# EAGLE design ArduinoUNO_Connexions (EAGLE 9.2.1)
Assembly variants: Actual
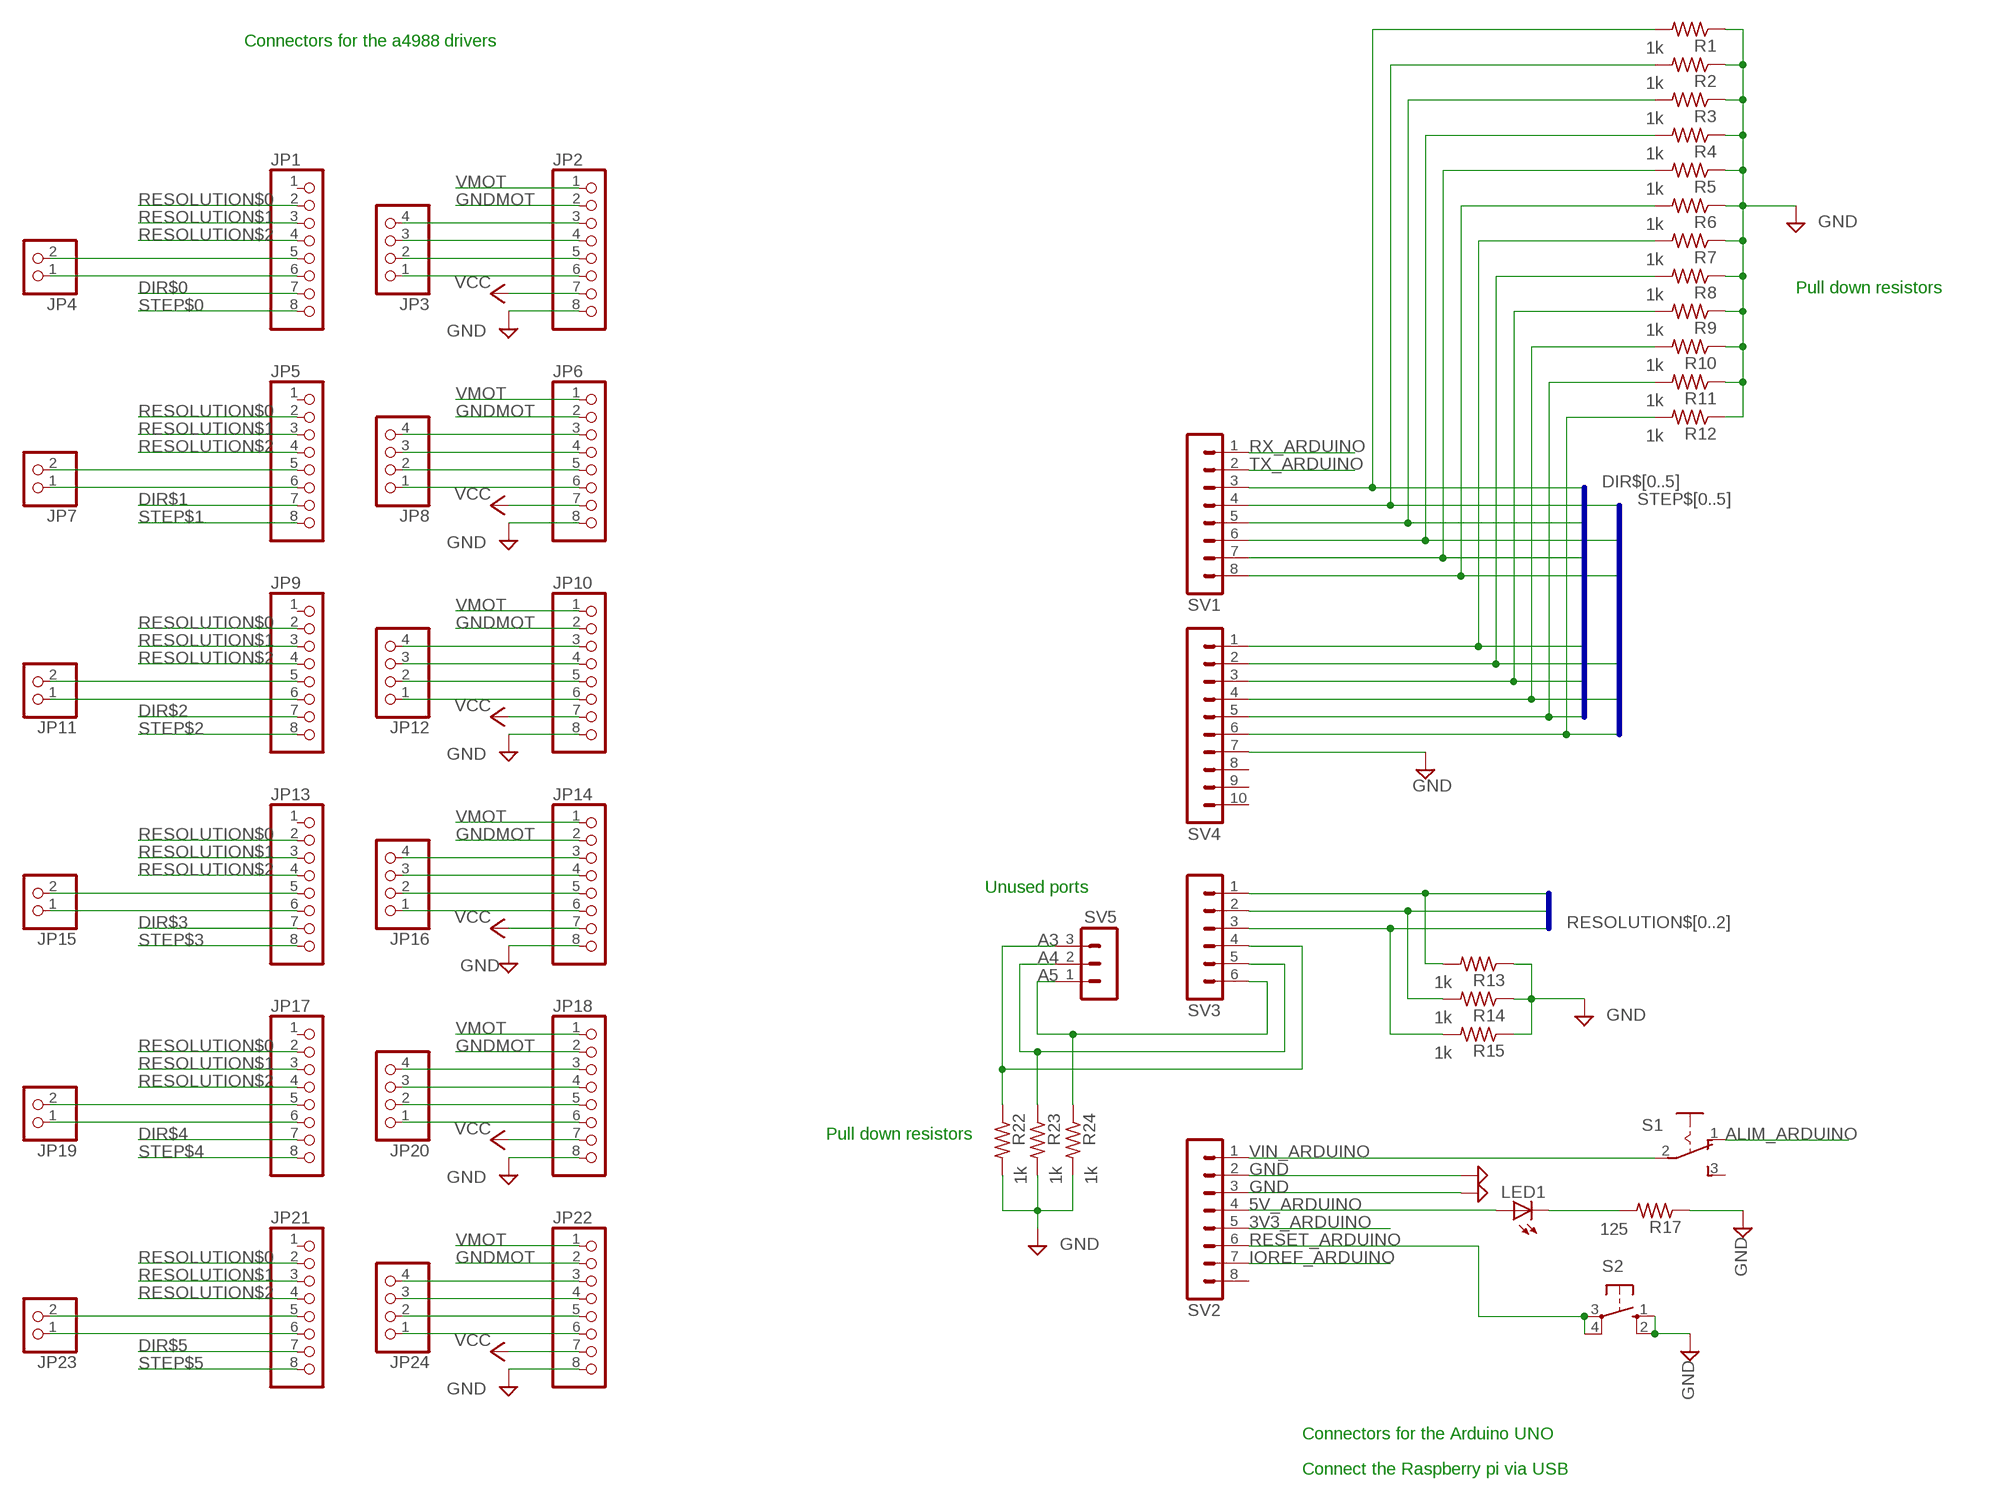
[diagram p0: schematic, sheet 1, part 1 of 2]
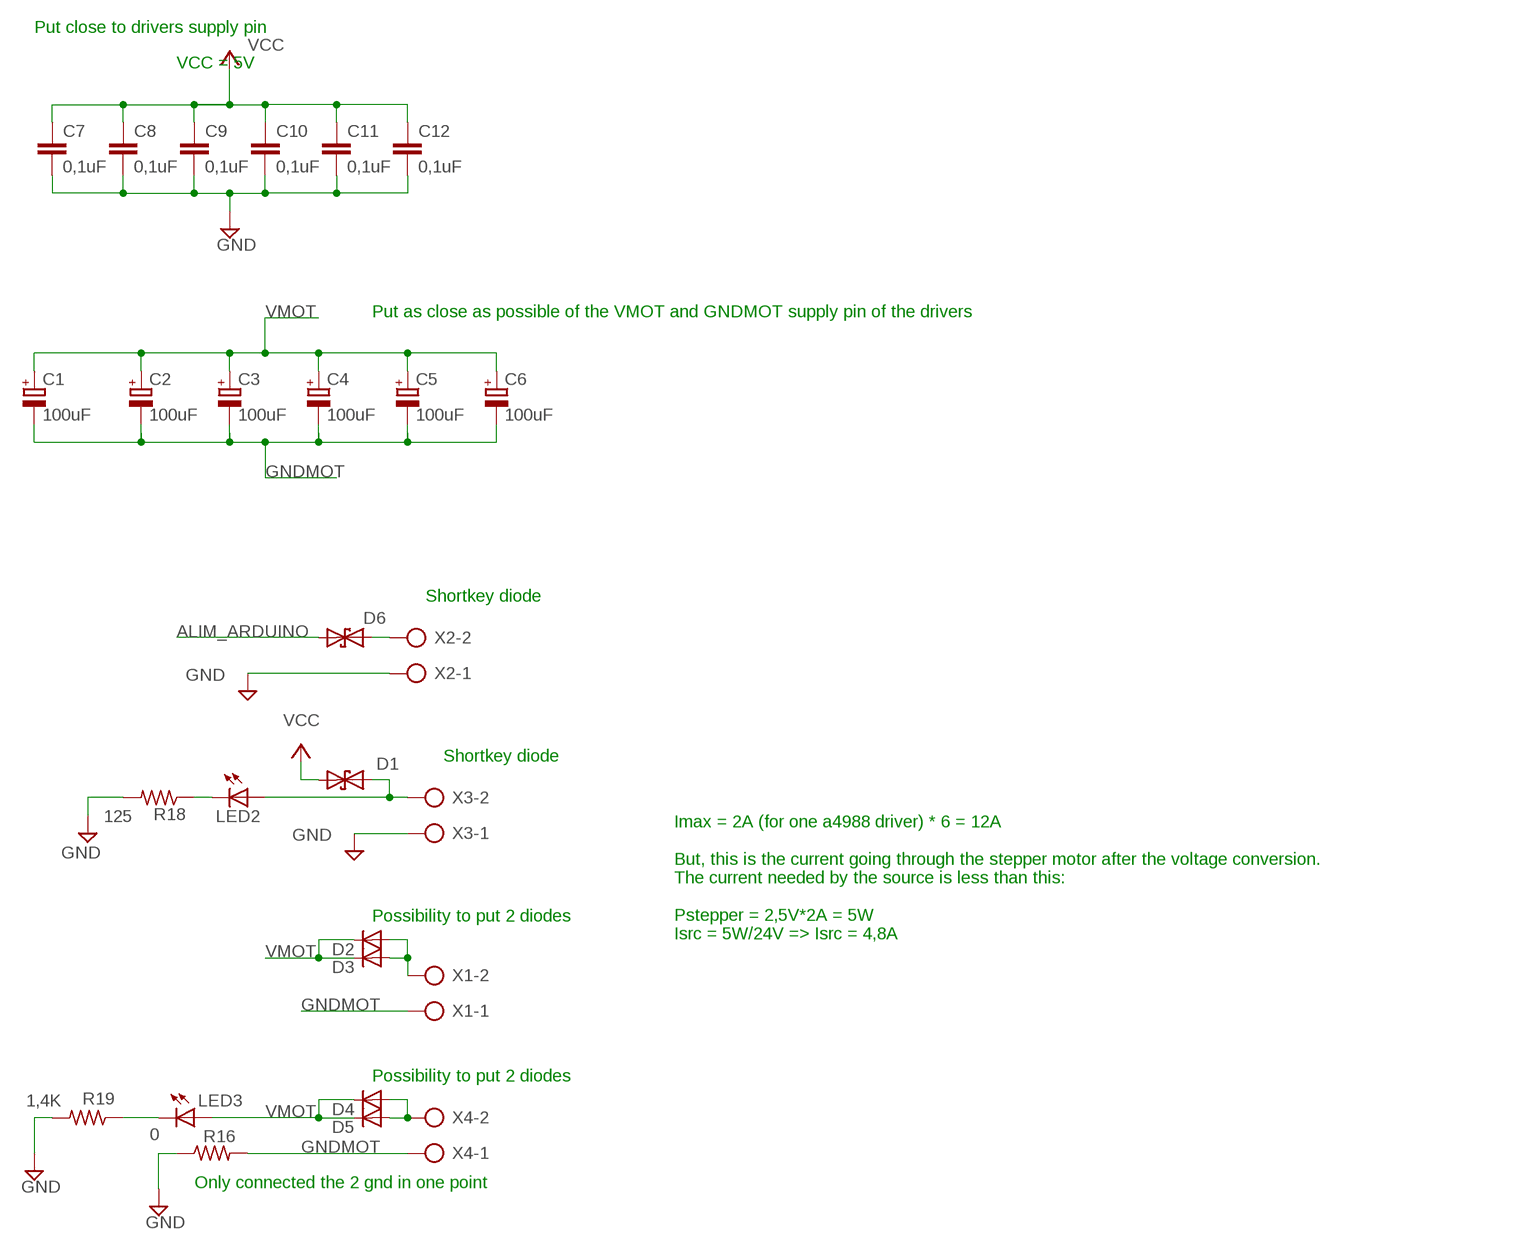
[diagram p1: schematic, sheet 1, part 2 of 2]

## Parts
C1  100uF  CPOL-EUE5-10.5  [E5-10,5]
C2  100uF  CPOL-EUE5-10.5  [E5-10,5]
C3  100uF  CPOL-EUE5-10.5  [E5-10,5]
C4  100uF  CPOL-EUE5-10.5  [E5-10,5]
C5  100uF  CPOL-EUE5-10.5  [E5-10,5]
C6  100uF  CPOL-EUE5-10.5  [E5-10,5]
C7  0,1uF  C-EU050-030X075  [C050-030X075]
C8  0,1uF  C-EU050-030X075  [C050-030X075]
C9  0,1uF  C-EU050-030X075  [C050-030X075]
C10  0,1uF  C-EU050-030X075  [C050-030X075]
C11  0,1uF  C-EU050-030X075  [C050-030X075]
C12  0,1uF  C-EU050-030X075  [C050-030X075]
D1  DIODE_SCHOTTKY2-F126-12  [F126Z12]
D2  1N5400  [DO201-15]
D3  1N5400  [DO201-15]
D4  1N5400  [DO201-15]
D5  1N5400  [DO201-15]
D6  DIODE_SCHOTTKY2-F126-12  [F126Z12]
JP1  PINHD-1X8  [1X08]
JP2  PINHD-1X8  [1X08]
JP3  PINHD-1X4  [1X04]
JP4  PINHD-1X2  [1X02]
JP5  PINHD-1X8  [1X08]
JP6  PINHD-1X8  [1X08]
JP7  PINHD-1X2  [1X02]
JP8  PINHD-1X4  [1X04]
JP9  PINHD-1X8  [1X08]
JP10  PINHD-1X8  [1X08]
JP11  PINHD-1X2  [1X02]
JP12  PINHD-1X4  [1X04]
JP13  PINHD-1X8  [1X08]
JP14  PINHD-1X8  [1X08]
JP15  PINHD-1X2  [1X02]
JP16  PINHD-1X4  [1X04]
JP17  PINHD-1X8  [1X08]
JP18  PINHD-1X8  [1X08]
JP19  PINHD-1X2  [1X02]
JP20  PINHD-1X4  [1X04]
JP21  PINHD-1X8  [1X08]
JP22  PINHD-1X8  [1X08]
JP23  PINHD-1X2  [1X02]
JP24  PINHD-1X4  [1X04]
LED1  LED5MM  [LED5MM]
LED2  LED5MM  [LED5MM]
LED3  LED5MM  [LED5MM]
R1  1k  R-US_0207/7  [0207/7]  (not fitted in variant Actual)
R2  1k  R-US_0207/7  [0207/7]  (not fitted in variant Actual)
R3  1k  R-US_0207/7  [0207/7]  (not fitted in variant Actual)
R4  1k  R-US_0207/7  [0207/7]  (not fitted in variant Actual)
R5  1k  R-US_0207/7  [0207/7]  (not fitted in variant Actual)
R6  1k  R-US_0207/7  [0207/7]  (not fitted in variant Actual)
R7  1k  R-US_0207/7  [0207/7]  (not fitted in variant Actual)
R8  1k  R-US_0207/7  [0207/7]  (not fitted in variant Actual)
R9  1k  R-US_0207/7  [0207/7]  (not fitted in variant Actual)
R10  1k  R-US_0207/7  [0207/7]  (not fitted in variant Actual)
R11  1k  R-US_0207/7  [0207/7]  (not fitted in variant Actual)
R12  1k  R-US_0207/7  [0207/7]  (not fitted in variant Actual)
R13  1k  R-US_0207/7  [0207/7]  (not fitted in variant Actual)
R14  1k  R-US_0207/7  [0207/7]  (not fitted in variant Actual)
R15  1k  R-US_0207/7  [0207/7]  (not fitted in variant Actual)
R16  0  R-US_0207/7  [0207/7]
R17  125  R-US_0207/7  [0207/7]
R18  125  R-US_0207/7  [0207/7]
R19  1,4K  R-US_0207/7  [0207/7]
R22  1k  R-US_0207/7  [0207/7]  (not fitted in variant Actual)
R23  1k  R-US_0207/7  [0207/7]  (not fitted in variant Actual)
R24  1k  R-US_0207/7  [0207/7]  (not fitted in variant Actual)
S1  255SB  [255SB]  (not fitted in variant Actual)
S2  10-XX  [B3F-10XX]
SV1  MA08-1  [MA08-1]
SV2  MA08-1  [MA08-1]
SV3  MA06-1  [MA06-1]
SV4  MA10-1  [MA10-1]
SV5  MA03-1  [MA03-1]
X1  AK500/2  [AK500/2]
X2  AK500/2  [AK500/2]
X3  AK500/2  [AK500/2]
X4  AK500/2  [AK500/2]

## Nets
3V3_ARDUINO: SV2.5
5V_ARDUINO: LED1.A SV2.4
A3: R22.1 SV3.4 SV5.3
A4: R23.1 SV3.5 SV5.2
A5: R24.1 SV3.6 SV5.1
ALIM_ARDUINO: D6.C S1.1(O)
DIR$0: JP1.7 R1.2 SV1.3
DIR$1: JP5.7 R3.2 SV1.5
DIR$2: JP9.7 R5.2 SV1.7
DIR$3: JP13.7 R7.2 SV4.1
DIR$4: JP17.7 R9.2 SV4.3
DIR$5: JP21.7 R11.2 SV4.5
GND: C7.2 C8.2 C9.2 C10.2 C11.2 C12.2 JP2.8 JP6.8 JP10.8 JP14.8 JP18.8 JP22.8 R1.1 R2.1 R3.1 R4.1 R5.1 R6.1 R7.1 R8.1 R9.1 R10.1 R11.1 R12.1 R13.1 R14.1 R15.1 R16.1 R17.1 R18.2 R19.2 R22.2 R23.2 R24.2 S2.1(S) S2.2(S1) SV2.2 SV2.3 SV4.7 X2.1 X3.1
GNDMOT: C1.- C2.- C3.- C4.- C5.- C6.- JP2.2 JP6.2 JP10.2 JP14.2 JP18.2 JP22.2 R16.2 X1.1 X4.1
IOREF_ARDUINO: SV2.7
N$1: D4.A D5.A X4.2
N$2: D1.A LED2.A X3.2
N$4: LED1.K(C) R17.2
N$5: JP2.3 JP3.4
N$6: LED3.K(C) R19.1
N$7: LED2.K(C) R18.1
N$8: JP2.4 JP3.3
N$9: JP2.5 JP3.2
N$10: JP1.5 JP4.2
N$11: JP1.6 JP4.1
N$12: JP2.6 JP3.1
N$13: JP5.5 JP7.2
N$14: JP5.6 JP7.1
N$15: JP6.3 JP8.4
N$16: JP6.4 JP8.3
N$17: JP6.5 JP8.2
N$18: JP6.6 JP8.1
N$19: JP9.5 JP11.2
N$20: JP9.6 JP11.1
N$21: JP10.3 JP12.4
N$22: JP10.4 JP12.3
N$23: JP10.5 JP12.2
N$24: JP10.6 JP12.1
N$25: JP13.5 JP15.2
N$26: JP13.6 JP15.1
N$27: JP14.3 JP16.4
N$28: JP14.4 JP16.3
N$29: JP14.5 JP16.2
N$30: JP14.6 JP16.1
N$31: JP17.5 JP19.2
N$32: JP17.6 JP19.1
N$33: JP18.3 JP20.4
N$34: JP18.4 JP20.3
N$35: JP18.5 JP20.2
N$36: JP18.6 JP20.1
N$37: JP21.5 JP23.2
N$38: JP21.6 JP23.1
N$39: JP22.3 JP24.4
N$40: JP22.4 JP24.3
N$41: JP22.5 JP24.2
N$42: JP22.6 JP24.1
N$44: D6.A X2.2
N$56: D2.A D3.A X1.2
RESET_ARDUINO: S2.3(P) S2.4(P1) SV2.6
RESOLUTION$0: JP1.2 JP5.2 JP9.2 JP13.2 JP17.2 JP21.2 R13.2 SV3.1
RESOLUTION$1: JP1.3 JP5.3 JP9.3 JP13.3 JP17.3 JP21.3 R14.2 SV3.2
RESOLUTION$2: JP1.4 JP5.4 JP9.4 JP13.4 JP17.4 JP21.4 R15.2 SV3.3
RX_ARDUINO: SV1.1
STEP$0: JP1.8 R2.2 SV1.4
STEP$1: JP5.8 R4.2 SV1.6
STEP$2: JP9.8 R6.2 SV1.8
STEP$3: JP13.8 R8.2 SV4.2
STEP$4: JP17.8 R10.2 SV4.4
STEP$5: JP21.8 R12.2 SV4.6
TX_ARDUINO: SV1.2
VCC: C7.1 C8.1 C9.1 C10.1 C11.1 C12.1 D1.C JP2.7 JP6.7 JP10.7 JP14.7 JP18.7 JP22.7
VIN_ARDUINO: S1.2(P) SV2.1
VMOT: C1.+ C2.+ C3.+ C4.+ C5.+ C6.+ D2.C D3.C D4.C D5.C JP2.1 JP6.1 JP10.1 JP14.1 JP18.1 JP22.1 LED3.A
Unconnected: JP1.1 JP5.1 JP9.1 JP13.1 JP17.1 JP21.1 S1.3(S) SV2.8 SV4.8 SV4.9 SV4.10

## Buses
RESOLUTION$[0..2]
STEP$[0..5]
DIR$[0..5]

## Notes on the sheet
- Connectors for the a4988 drivers
- Put close to drivers supply pin
- VCC = 5V
- Pull down resistors
- Put as close as possible of the VMOT and GNDMOT supply pin of the drivers
- Shortkey diode
- Shortkey diode
- Unused ports
- Possibility to put 2 diodes
- Imax = 2A (for one a4988 driver) * 6 = 12A
  
  But, this is the current going through the stepper motor after the voltage conversion.
  The current needed by the source is less than this:
  
  Pstepper = 2,5V*2A = 5W
  Isrc = 5W/24V => Isrc = 4,8A
- Pull down resistors
- Possibility to put 2 diodes
- Only connected the 2 gnd in one point
- Connectors for the Arduino UNO
- Connect the Raspberry pi via USB

## Library data of the parts
C1-C6 = rcl:CPOL-EU: POLARIZED CAPACITOR, European symbol; SPICEPREFIX: C
C7-C12 = rcl:C-EU: CAPACITOR, European symbol; SPICEPREFIX: C
D1 D6 = diode:DIODE_SCHOTTKY2-: Schottky Bidirectional Diode
D2-D5 = diode:1N5400: DIODE standard rectifier, 3 A, 50 V (Motorola)
JP1 JP2 JP5 JP6 JP9 JP10 JP13 JP14 JP17 JP18 JP21 JP22 = pinhead:PINHD-1X8: PIN HEADER
JP3 JP8 JP12 JP16 JP20 JP24 = pinhead:PINHD-1X4: PIN HEADER
JP4 JP7 JP11 JP15 JP19 JP23 = pinhead:PINHD-1X2: PIN HEADER
LED1-LED3 = led:LED: LED OSRAM: - CHIPLED LG R971, LG N971, LY N971, LG Q971, LY Q971, LO R971, LY R971 LH N974, LH R974 LS Q976, LO Q976, LY Q976 LO Q996 - Hyper CHIPLED LW Q18S LB Q993, LB Q99A, LB R99A - SideLED LS A670, LO A670, LY A670, LG A670, LP A670 LB A673, LV A673, LT A673, LW A673 LH A674 LY A675 LS A676, LA A676, LO A676, LY A676, LW A676 LS A679, LY A679, LG A679 - Hyper Micro SIDELED® LS Y876, LA Y876, LO Y876, LY Y876 LT Y87S - SmartLED LW L88C, LW L88S LB L89C, LB L89S, LG L890 LS L89K, LO L89K, LY L89K LS L896, LA L896, LO L896, LY L896 - TOPLED LS T670, LO T670, LY T670, LG T670, LP T670 LSG T670, LSP T670, LSY T670, LOP T670, LYG T670 LG T671, LOG T671, LSG T671 LB T673, LV T673, LT T673, LW T673 LH T674 LS T676, LA T676, LO T676, LY T676, LB T676, LH T676, LSB T676, LW T676 LB T67C, LV T67C, LT T67C, LS T67K, LO T67K, LY T67K, LW E67C LS E67B, LA E67B, LO E67B, LY E67B, LB E67C, LV E67C, LT E67C LW T67C LS T679, LY T679, LG T679 LS T770, LO T770, LY T770, LG T770, LP T770 LB T773, LV T773, LT T773, LW T773 LH T774 LS E675, LA E675, LY E675, LS T675 LS T776, LA T776, LO T776, LY T776, LB T776 LHGB T686 LT T68C, LB T68C - Hyper Mini TOPLED® LB M676 - Mini TOPLED Santana® LG M470 LS M47K, LO M47K, LY M47K Source: http://www.osram.convergy.de LUXEON: - LUMILED® LXK2-PW12-R00, LXK2-PW12-S00, LXK2-PW14-U00, LXK2-PW14-V00 LXK2-PM12-R00, LXK2-PM12-S00, LXK2-PM14-U00 LXK2-PE12-Q00, LXK2-PE12-R00, LXK2-PE12-S00, LXK2-PE14-T00, LXK2-PE14-U00 LXK2-PB12-K00, LXK2-PB12-L00, LXK2-PB12-M00, LXK2-PB14-N00, LXK2-PB14-P00, LXK2-PB14-Q00 LXK2-PR12-L00, LXK2-PR12-M00, LXK2-PR14-Q00, LXK2-PR14-R00 LXK2-PD12-Q00, LXK2-PD12-R00, LXK2-PD12-S00 LXK2-PH12-R00, LXK2-PH12-S00 LXK2-PL12-P00, LXK2-PL12-Q00, LXK2-PL12-R00 Source: www.luxeon.com KINGBRIGHT: KA-3528ASYC Source: www.kingbright.com
R1-R19 R22-R24 = rcl:R-US_: RESISTOR, American symbol; SPICEPREFIX: R
S1 = switch:255SB: SLIDING SWITCH Distributor Buerklin, 11G810
S2 = switch-omron:10-XX: OMRON SWITCH; MPN: B3F-1000; OC_FARNELL: 176432; OC_NEWARK: 36M3542
SV1 SV2 = con-lstb:MA08-1: PIN HEADER; OC_FARNELL: unknown; OC_NEWARK: unknown
SV3 = con-lstb:MA06-1: PIN HEADER; OC_FARNELL: unknown; OC_NEWARK: unknown
SV4 = con-lstb:MA10-1: PIN HEADER; OC_FARNELL: unknown; OC_NEWARK: unknown
SV5 = con-lstb:MA03-1: PIN HEADER; OC_FARNELL: unknown; OC_NEWARK: unknown
X1-X4 = con-ptr500:AK500/2: CONNECTOR; OC_FARNELL: unknown; OC_NEWARK: unknown

## Module ARDUINO
Ports: 

### Library data of the parts

## Board
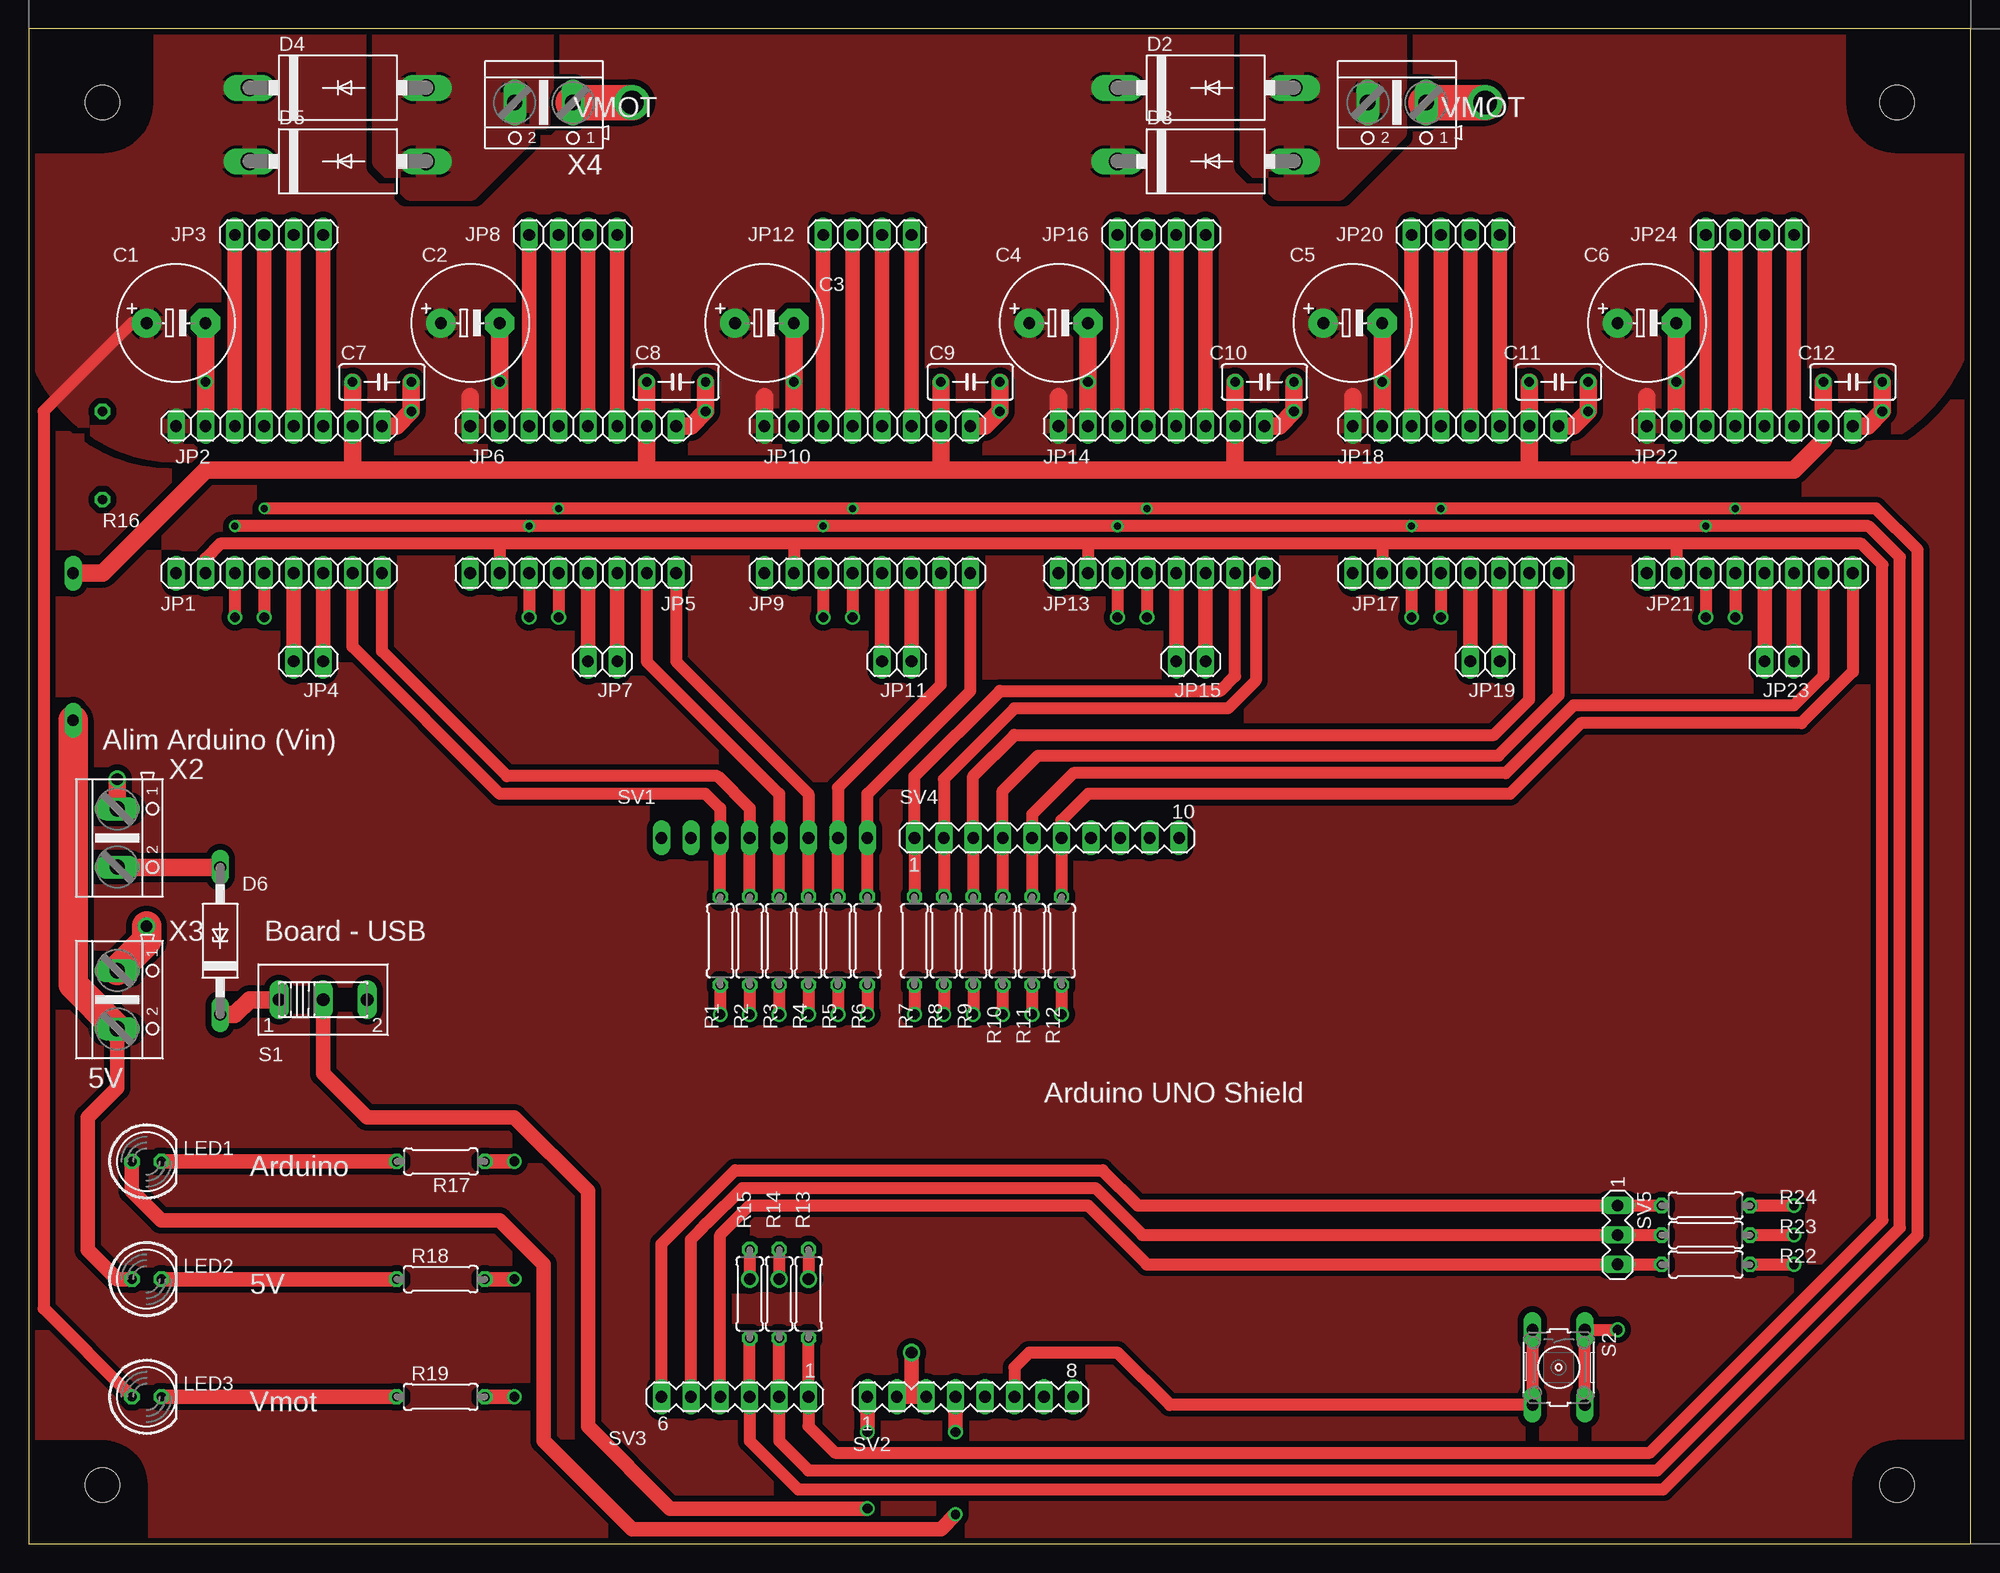
[diagram p2: board, top side]
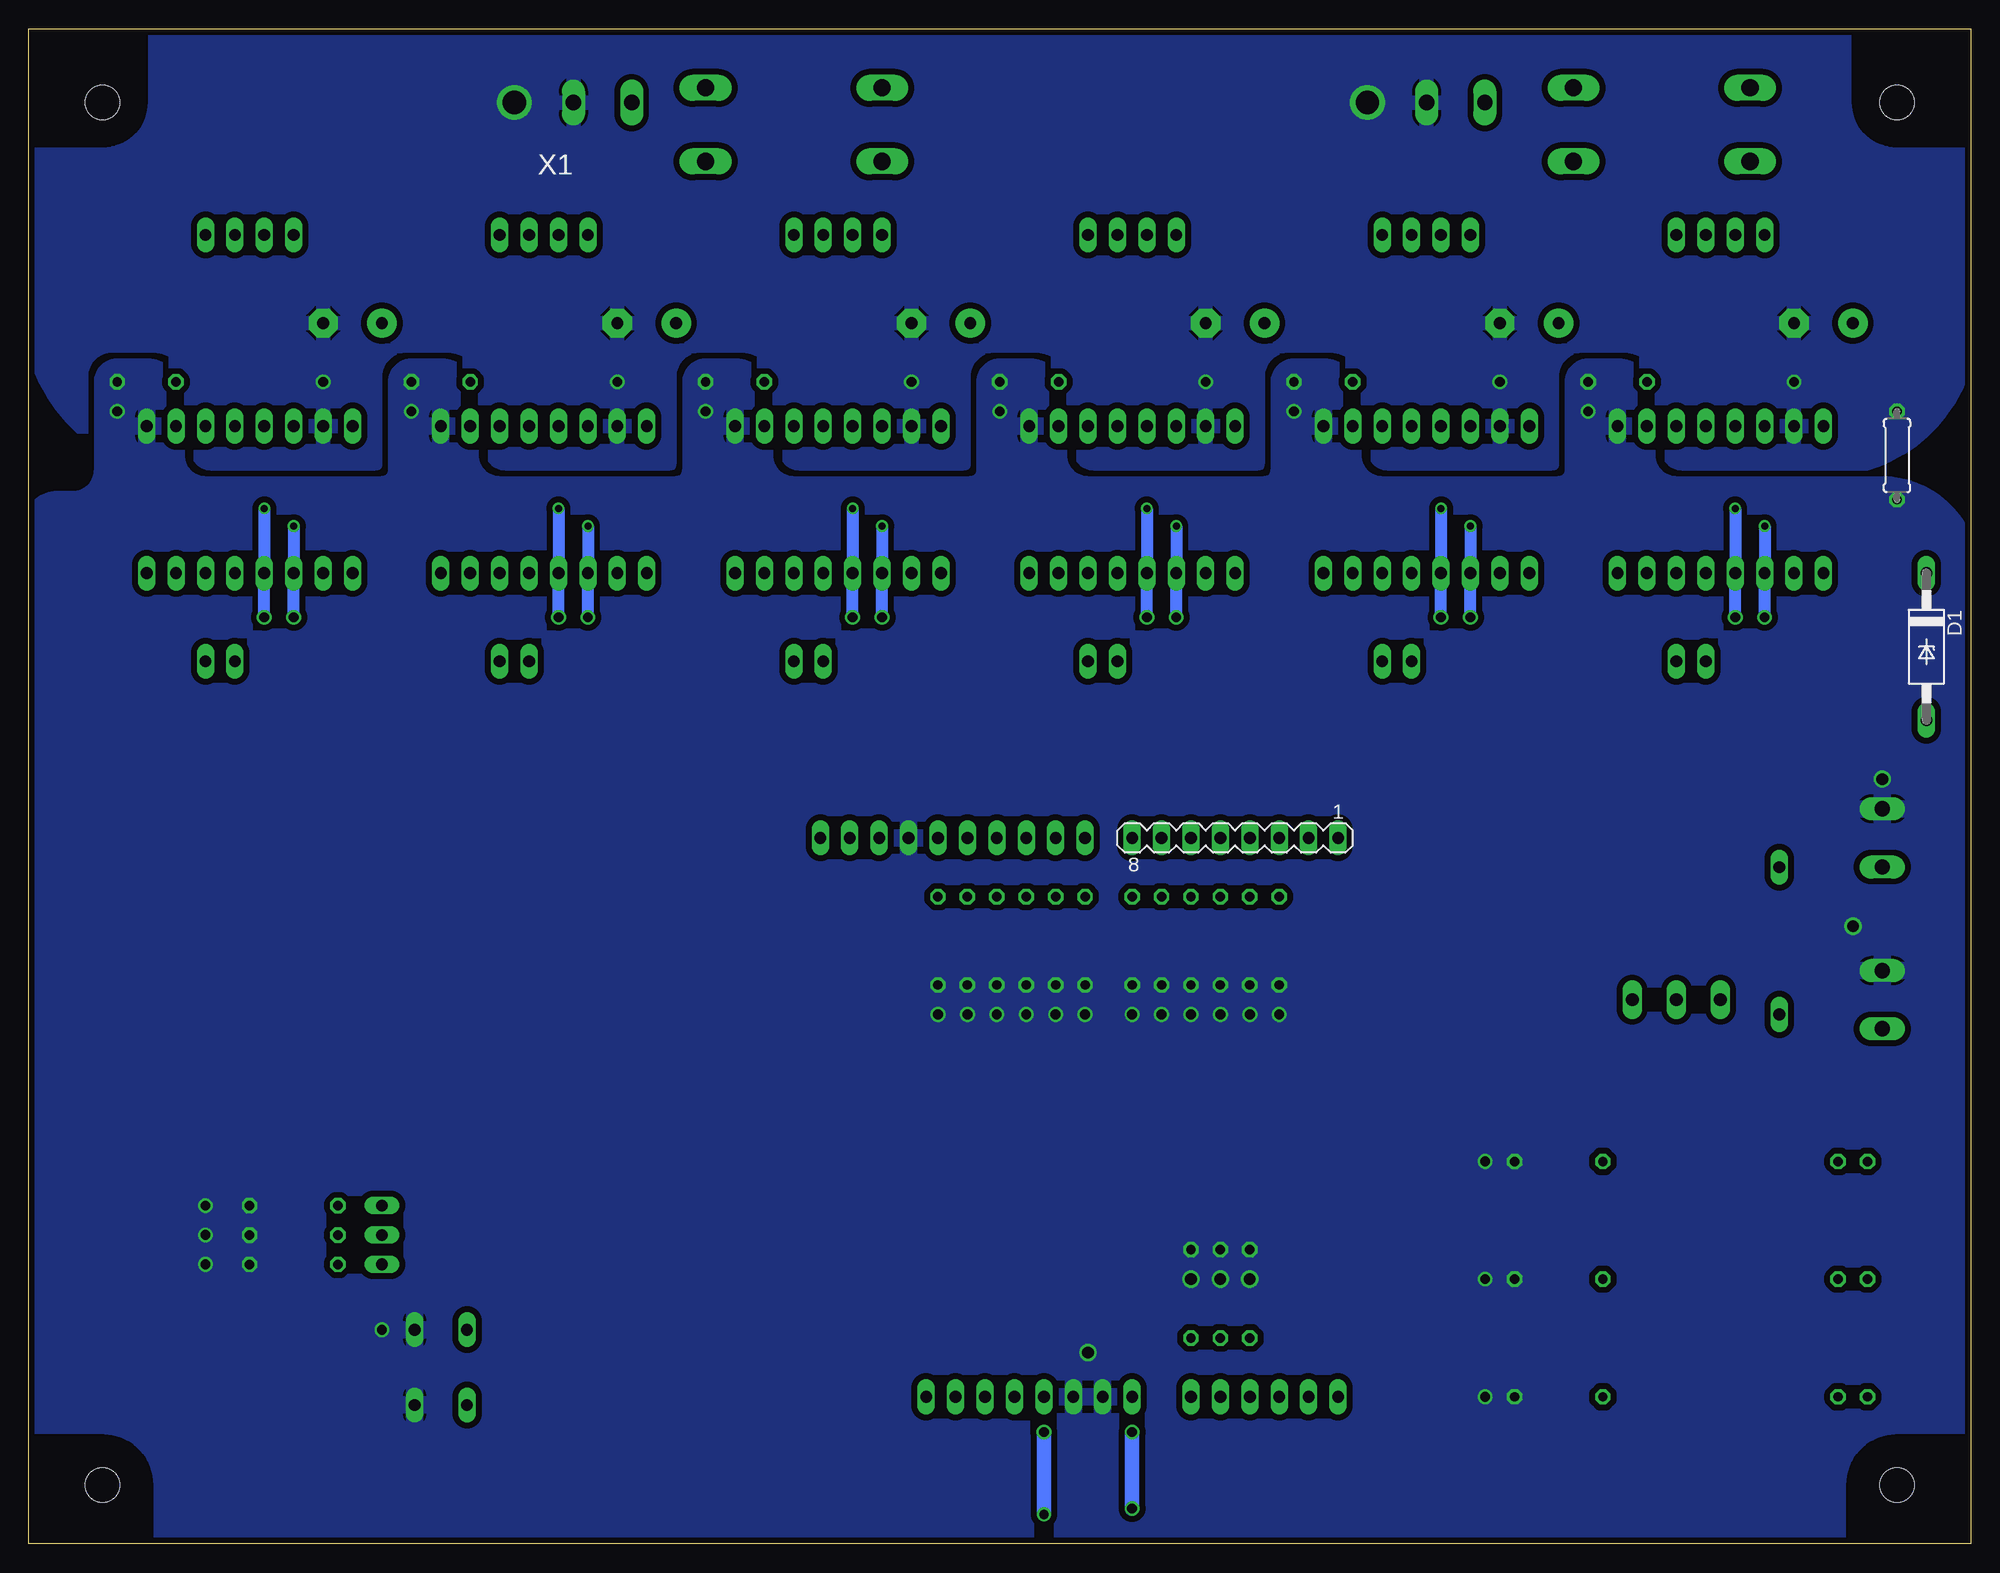
[diagram p3: board, bottom side, seen from below]

Size 167.64 x 130.81 mm. Coordinates in mm from the lower left corner, seen from the top.
Outline: 0,0 167.64,0 167.64,130.81 0,130.81 0,0
Copper layers (1*16): Top 0.035mm / dielectric 1.5mm / Bottom 0.035mm
Design rules "default *": minimum track width 20mil, minimum drill 0.6mm, track to track 20mil, track to pad 20mil, pad to pad 20mil, via to via 20mil, smd to smd 6mil, copper to edge 20mil, drill to drill 20mil, minimum pad ring 10mil, minimum via ring 8mil, stop-mask expansion 4mil, vias tented up to drill 0mil, thermal gap 10mil
Holes 3 mm at 6.35,124.46 6.35,5.08 161.29,5.08 161.29,124.46
tRestrict: area 0,120.7 to 10.2,130.8; area 157.5,120.7 to 167.6,130.8; area 157.5,0 to 167.6,8.9; area 0,0 to 10.2,8.9
bRestrict: area 0,0 to 10.2,8.9; area 157.5,0 to 167.6,8.9; area 157.5,120.7 to 167.6,130.8; area 0,120.7 to 10.2,130.8

### Footprints (pad centres in the part's own frame; a part is rotated, then mirrored left to right if it is on the bottom)
E5-10,5 = drill 1.016 pad 2.54: + -2.54,0 | drill 1.016 pad 2.54 octagon: - 2.54,0
C050-030X075 = drill 0.813 octagon: 1 -2.54,0; 2 2.54,0
F126Z12 = drill 1.016 long: A 6.35,0; C -6.35,0
DO201-15 = drill 1.499 long: A 7.62,0; C -7.62,0
1X08 = drill 1.016 long: 1 -8.89,0; 2 -6.35,0; 3 -3.81,0; 4 -1.27,0; 5 1.27,0; 6 3.81,0; 7 6.35,0; 8 8.89,0
1X04 = drill 1.016 long: 1 -3.81,0; 2 -1.27,0; 3 1.27,0; 4 3.81,0
1X02 = drill 1.016 long: 1 -1.27,0; 2 1.27,0
LED5MM = drill 0.813 octagon: A -1.27,0; K 1.27,0
0207/7 = drill 0.813 octagon: 1 -3.81,0; 2 3.81,0
255SB = drill 1.118 long: 1 -3.81,0; 2 0,0; 3 3.81,0
B3F-10XX = drill 1.016 long: 1 -3.251,2.261; 2 3.251,2.261; 3 -3.251,-2.261; 4 3.251,-2.261
MA08-1 = drill 1.016 long: 1 -8.89,0; 2 -6.35,0; 3 -3.81,0; 4 -1.27,0; 5 1.27,0; 6 3.81,0; 7 6.35,0; 8 8.89,0
MA06-1 = drill 1.016 long: 1 -6.35,0; 2 -3.81,0; 3 -1.27,0; 4 1.27,0; 5 3.81,0; 6 6.35,0
MA10-1 = drill 1.016 long: 1 -11.43,0; 2 -8.89,0; 3 -6.35,0; 4 -3.81,0; 5 -1.27,0; 6 1.27,0; 7 3.81,0; 8 6.35,0; 9 8.89,0; 10 11.43,0
MA03-1 = drill 1.016 long: 1 -2.54,0; 2 0,0; 3 2.54,0
AK500/2 = drill 1.321 long: 1 -2.515,0; 2 2.515,0

### Placement (x,y rotation side)
C1  12.7,105.41 0 top
C2  38.1,105.41 0 top
C3  63.5,105.41 0 top
C4  88.9,105.41 0 top
C5  114.3,105.41 0 top
C6  139.7,105.41 0 top
C7  30.48,100.33 0 top
C8  55.88,100.33 0 top
C9  81.28,100.33 0 top
C10  106.68,100.33 0 top
C11  132.08,100.33 0 top
C12  157.48,100.33 0 top
D1  3.81,77.47 270 bottom
D2  101.6,125.73 0 top
D3  101.6,119.38 0 top
D4  26.67,125.73 0 top
D5  26.67,119.38 0 top
D6  16.51,52.07 90 top
JP1  21.59,83.82 0 top
JP2  21.59,96.52 0 top
JP3  21.59,113.03 180 top
JP4  24.13,76.2 180 top
JP5  46.99,83.82 0 top
JP6  46.99,96.52 0 top
JP7  49.53,76.2 180 top
JP8  46.99,113.03 180 top
JP9  72.39,83.82 0 top
JP10  72.39,96.52 0 top
JP11  74.93,76.2 180 top
JP12  72.39,113.03 180 top
JP13  97.79,83.82 0 top
JP14  97.79,96.52 0 top
JP15  100.33,76.2 180 top
JP16  97.79,113.03 180 top
JP17  123.19,83.82 0 top
JP18  123.19,96.52 0 top
JP19  125.73,76.2 180 top
JP20  123.19,113.03 180 top
JP21  148.59,83.82 0 top
JP22  148.59,96.52 0 top
JP23  151.13,76.2 180 top
JP24  148.59,113.03 180 top
LED1  10.16,33.02 0 top
LED2  10.16,22.86 0 top
LED3  10.16,12.7 0 top
R1  59.69,52.07 90 top
R2  62.23,52.07 90 top
R3  64.77,52.07 90 top
R4  67.31,52.07 90 top
R5  69.85,52.07 90 top
R6  72.39,52.07 90 top
R7  76.45,52.07 90 top
R8  78.99,52.07 90 top
R9  81.53,52.07 90 top
R10  84.07,52.07 90 top
R11  86.61,52.07 90 top
R12  89.15,52.07 90 top
R13  67.31,21.59 270 top
R14  64.77,21.59 270 top
R15  62.23,21.59 270 top
R16  6.35,93.98 90 bottom
R17  35.56,33.02 180 top
R18  35.56,22.86 0 top
R19  35.56,12.7 0 top
R22  144.78,24.13 0 top
R23  144.78,26.67 0 top
R24  144.78,29.21 0 top
S1  25.4,46.99 0 top
S2  132.08,15.24 270 top
SV1  63.5,60.96 180 bottom
SV2  81.28,12.7 0 top
SV3  60.96,12.7 180 top
SV4  87.88,60.96 0 top
SV5  137.16,26.67 270 top
X1  118.11,124.46 180 top
X2  7.62,60.96 270 top
X3  7.62,46.99 270 top
X4  44.45,124.46 180 top

### Tracks (layer width: path | path; a pad name or v marks a point on that pad's centre or on a via)
5V_ARDUINO  (via drill 0.8, 0.85)
  Top 1.27: LED1.A 8.89,30.48 11.43,27.94 40.64,27.94 44.45,24.13 44.45,8.89 52.07,1.27 78.74,1.27 v80.01,2.54 | SV2.4 v80.01,9.65
  Bottom 1.27: v80.01,9.65 v80.01,2.54
A3
  Top 1.016: SV3.4 59.69,26.67 62.23,29.21 91.44,29.21 96.52,24.13 SV5.3 R22.1
A4
  Top 1.016: R23.1 SV5.2 96.14,26.67 92.07,30.73 61.6,30.73 58.61,27.75 57.91,27.05 57.15,26.29 SV3.5
A5
  Top 1.016: SV3.6 54.61,25.9 60.97,32.26 92.7,32.26 95.75,29.21 SV5.1 R24.1
ALIM_ARDUINO
  Top 1.524: D6.C 17.78,45.72 19.05,46.99 S1.1
DIR$0
  Top 1.016: JP1.7 27.94,77.47 40.64,64.77 58.42,64.77 59.69,63.5 SV1.3 R1.2
DIR$1
  Top 1.016: JP5.7 53.34,76.2 64.77,64.77 SV1.5 R3.2
DIR$2
  Top 1.016: JP9.7 78.74,74.19 69.85,65.3 SV1.7 R5.2
DIR$3
  Top 1.016: JP13.7 104.14,74.93 102.87,73.66 83.82,73.66 76.45,66.29 SV4.1 R7.2
DIR$4
  Top 1.016: JP17.7 129.54,72.89 126.5,69.85 85.09,69.85 81.53,66.29 SV4.3 R9.2
DIR$5
  Top 1.016: JP21.7 154.94,74.93 152.4,72.39 133.35,72.39 127.51,66.55 90.17,66.55 86.61,62.99 SV4.5 R11.2
GND  (via drill 0.85, 1)
  Top 1.016: R1.1 v59.69,45.72 | R2.1 v62.23,45.72 | R3.1 v64.77,45.72 | R4.1 v67.31,45.72 | R5.1 v69.85,45.72 | R6.1 v72.39,45.72 | R7.1 76.45,45.97 v76.45,45.72 | R8.1 78.99,45.97 v78.99,45.72 | R9.1 81.53,45.97 v81.53,45.72 | R10.1 84.07,45.97 v84.07,45.72 | R11.1 86.61,45.97 v86.61,45.72 | R12.1 89.15,45.97 v89.15,45.72 | R24.2 v152.4,29.21 | R23.2 v152.4,26.67 | R22.2 v152.4,24.13 | S2.2 S2.1 v137.16,18.49 | R15.1 v62.23,22.86 | R14.1 v64.77,22.86 | R13.1 v67.31,22.86
  Top 1.27: R17.1 v41.91,33.02 | R18.2 v41.91,22.86 | R19.2 v41.91,12.7 | SV2.3 76.2,12.7 | 76.2,12.7 v76.2,16.51 | SV2.2 76.2,12.7
  Top 1.524: JP2.8 31.75,96.52 v33.02,97.79 C7.2 | JP6.8 57.15,96.52 v58.42,97.79 C8.2 | JP10.8 82.55,96.52 v83.82,97.79 C9.2 | JP14.8 107.95,96.52 v109.22,97.79 C10.2 | JP18.8 133.35,96.52 v134.62,97.79 C11.2 | JP22.8 158.75,96.52 v160.02,97.79 C12.2 | X2.1 v7.62,66.04
  Top 2.54: X3.1 10.16,52.05 v10.16,53.34
  pour Bottom (isolate 0.508): 0,0 0,83.82 arc-90 7.62,91.44 25.4,91.44 arc90 27.94,93.98 27.94,99.06 arc-90 30.48,101.6 33.02,101.6 arc-90 34.29,100.33 34.29,92.71 arc90 35.56,91.44 36.83,91.44 50.8,91.44 arc90 53.34,93.98 53.34,99.06 arc-90 55.88,101.6 58.42,101.6 arc-90 59.69,100.33 59.69,92.71 arc90 60.96,91.44 62.23,91.44 76.2,91.44 arc90 78.74,93.98 78.74,99.06 arc-90 81.28,101.6 83.82,101.6 arc-90 85.09,100.33 85.09,97.79 85.09,92.71 arc90 86.36,91.44 88.9,91.44 101.6,91.44 arc90 104.14,93.98 104.14,99.06 arc-90 106.68,101.6 109.22,101.6 arc-90 110.49,100.33 110.49,99.06 110.49,92.71 arc90 111.76,91.44 113.03,91.44 127,91.44 arc90 129.54,93.98 129.54,99.06 arc-90 132.08,101.6 134.62,101.6 arc-90 135.89,100.33 135.89,99.06 135.89,92.71 arc90 137.16,91.44 138.43,91.44 152.4,91.44 arc90 154.94,93.98 154.94,96.52 154.94,99.06 arc-90 157.48,101.6 160.02,101.6 arc-90 161.29,100.33 161.29,92.71 arc90 163.83,90.17 165.1,90.17 arc-90 167.64,87.63 167.64,86.36 167.64,0
GNDMOT  (via drill 0.85, 2)
  Top 1.524: JP2.2 v15.24,100.33 C1.- | JP6.2 v40.64,100.33 C2.- | JP10.2 v66.04,100.33 C3.- | JP14.2 v91.44,100.33 C4.- | JP18.2 v116.84,100.33 C5.- | JP22.2 v142.24,100.33 C6.-
  Top 3.048: X4.1 v52.07,124.46 | X1.1 v125.73,124.46
  pour Bottom (rank 2): 0,130.81 0,105.41 arc90 12.7,92.71 16.51,92.71 153.67,92.71 arc90 167.64,106.68 167.64,130.81
N$1
  pour Top: 30.48,130.81 30.48,119.38 33.02,116.84 38.1,116.84 44.45,123.19 44.45,130.81
N$2
  Top 1.27: LED2.A 7.62,22.86 5.08,25.4 5.08,36.83 7.62,39.37 X3.2
  Top 2.54: D1.A 3.81,48.28 X3.2
N$4
  Top 1.27: R17.2 LED1.K
N$5
  Top 1.27: JP2.3 JP3.4
N$6
  Top 1.27: R19.1 LED3.K
N$7
  Top 1.27: R18.1 LED2.K
N$8
  Top 1.27: JP2.4 JP3.3
N$9
  Top 1.27: JP2.5 JP3.2
N$10
  Top 1.27: JP4.2 JP1.5
N$11
  Top 1.27: JP4.1 JP1.6
N$12
  Top 1.27: JP2.6 JP3.1
N$13
  Top 1.27: JP7.2 JP5.5
N$14
  Top 1.27: JP7.1 JP5.6
N$15
  Top 1.27: JP6.3 JP8.4
N$16
  Top 1.27: JP6.4 JP8.3
N$17
  Top 1.27: JP6.5 JP8.2
N$18
  Top 1.27: JP6.6 JP8.1
N$19
  Top 1.27: JP11.2 JP9.5
N$20
  Top 1.27: JP11.1 JP9.6
N$21
  Top 1.27: JP10.3 JP12.4
N$22
  Top 1.27: JP10.4 JP12.3
N$23
  Top 1.27: JP10.5 JP12.2
N$24
  Top 1.27: JP10.6 JP12.1
N$25
  Top 1.27: JP15.2 JP13.5
N$26
  Top 1.27: JP15.1 JP13.6
N$27
  Top 1.27: JP14.3 JP16.4
N$28
  Top 1.27: JP14.4 JP16.3
N$29
  Top 1.27: JP14.5 JP16.2
N$30
  Top 1.27: JP14.6 JP16.1
N$31
  Top 1.27: JP19.2 JP17.5
N$32
  Top 1.27: JP19.1 JP17.6
N$33
  Top 1.27: JP18.3 JP20.4
N$34
  Top 1.27: JP18.4 JP20.3
N$35
  Top 1.27: JP18.5 JP20.2
N$36
  Top 1.27: JP18.6 JP20.1
N$37
  Top 1.27: JP23.2 JP21.5
N$38
  Top 1.27: JP23.1 JP21.6
N$39
  Top 1.016: JP22.3 JP24.4
N$40
  Top 1.27: JP22.4 JP24.3
N$41
  Top 1.27: JP22.5 JP24.2
N$42
  Top 1.27: JP22.6 JP24.1
N$44
  Top 1.524: X2.2 7.64,58.42 D6.A
N$56
  pour Top: 105.41,130.81 105.41,119.38 107.95,116.84 113.03,116.84 118.11,121.92 118.11,130.81
NONE
  pour Top (rank 3): 0,130.81 0,0 167.64,0 167.64,130.81
RESET_ARDUINO
  Top 1.016: SV2.6 85.09,15.24 86.36,16.51 93.98,16.51 98.5,11.99 S2.4 S2.3
RESOLUTION$0
  Top 1.016: R13.2 SV3.1 67.31,10.16 69.6,7.87 139.95,7.87 160.02,27.94 160.02,84.56 158.22,86.36 142.24,86.36 | JP1.2 15.24,85.09 16.51,86.36 40.64,86.36 | 142.24,86.36 116.84,86.36 | 116.84,86.36 91.44,86.36 | 91.44,86.36 66.04,86.36 | 66.04,86.36 40.64,86.36 | 40.64,86.36 JP5.2 | 66.04,86.36 JP9.2 | 91.44,86.36 JP13.2 | 116.84,86.36 JP17.2 | 142.24,86.36 JP21.2
RESOLUTION$1  (via drill 0.6, 0.85)
  Top 1.016: R14.2 SV3.2 64.77,8.89 67.31,6.35 140.59,6.35 161.54,27.31 161.54,85.19 158.85,87.88 v144.78,87.88 v119.38,87.88 v93.98,87.88 v68.58,87.88 v43.18,87.88 v17.78,87.88 | JP21.3 v144.78,80.01 | JP17.3 v119.38,80.01 | JP13.3 v93.98,80.01 | JP9.3 v68.58,80.01 | JP5.3 v43.18,80.01 | JP1.3 v17.78,80.01
  Bottom 1.016: v17.78,87.88 JP1.3 v17.78,80.01 | v43.18,87.88 JP5.3 v43.18,80.01 | v68.58,87.88 JP9.3 v68.58,80.01 | v93.98,87.88 JP13.3 v93.98,80.01 | v119.38,87.88 JP17.3 v119.38,80.01 | v144.78,87.88 JP21.3 v144.78,80.01
RESOLUTION$2  (via drill 0.6, 0.85)
  Top 1.016: R15.2 SV3.3 62.23,8.89 66.42,4.7 141.09,4.7 163.07,26.68 163.07,27.94 163.07,85.82 159.48,89.41 v147.32,89.41 v121.92,89.41 v96.52,89.41 v71.12,89.41 v45.72,89.41 v20.32,89.41 | JP21.4 v147.32,80.01 | JP17.4 v121.92,80.01 | JP13.4 v96.52,80.01 | JP9.4 v71.12,80.01 | JP5.4 v45.72,80.01 | JP1.4 v20.32,80.01
  Bottom 1.016: v20.32,89.41 JP1.4 v20.32,80.01 | v45.72,89.41 JP5.4 v45.72,80.01 | v71.12,89.41 JP9.4 v71.12,80.01 | v96.52,89.41 JP13.4 v96.52,80.01 | v121.92,89.41 JP17.4 v121.92,80.01 | v147.32,89.41 JP21.4 v147.32,80.01
STEP$0
  Top 1.016: JP1.8 30.48,77.08 41.27,66.29 59.44,66.29 62.23,63.5 SV1.4 R2.2
STEP$1
  Top 1.016: JP5.8 55.88,76.2 67.31,64.77 SV1.6 R4.2
STEP$2
  Top 1.016: JP9.8 81.28,73.66 72.39,64.77 SV1.8 R6.2
STEP$3
  Top 1.016: JP13.8 105.92,83.06 105.92,74.55 103.5,72.14 85.09,72.14 78.99,66.04 SV4.2 R8.2
STEP$4
  Top 1.016: JP17.8 132.08,73.28 126.88,68.07 87.12,68.07 84.07,65.02 SV4.4 R10.2
STEP$5
  Top 1.016: JP21.8 157.48,75.31 153.03,70.87 133.98,70.87 127.89,64.77 91.44,64.77 89.15,62.48 SV4.6 R12.2
VCC
  Top 1.524: D1.C 6.35,83.82 15.24,92.71 27.94,92.71 | 27.94,92.71 53.34,92.71 | 53.34,92.71 78.74,92.71 | 78.74,92.71 104.14,92.71 | 104.14,92.71 129.54,92.71 | 129.54,92.71 152.4,92.71 154.94,95.25 JP22.7 C12.1 | 129.54,92.71 JP18.7 C11.1 | 104.14,92.71 JP14.7 C10.1 | 78.74,92.71 JP10.7 C9.1 | 53.34,92.71 JP6.7 C8.1 | 27.94,92.71 JP2.7 C7.1
VIN_ARDUINO  (via drill 0.85)
  Top 1.27: S1.2 25.4,40.64 29.21,36.83 41.91,36.83 48.26,30.48 48.26,10.16 55.37,3.05 v72.39,3.05 | SV2.1 v72.39,9.65
  Bottom 1.27: v72.39,3.05 v72.39,9.65
VMOT
  Top 1.016: C1.+ 8.89,105.41 1.27,97.79 1.27,20.32 LED3.A
  Top 1.524: JP6.1 38.1,99.06 | JP10.1 63.5,99.06 | JP14.1 88.9,99.06 | JP18.1 114.3,99.06 | JP22.1 139.7,99.06
  pour Top (isolate 0.508, rank 2): 0,130.81 0,106.68 arc90 12.7,93.98 153.67,93.98 arc90 167.64,107.95 167.64,130.81

### Text on the board
tPlace: VMOT | VMOT | Alim Arduino (Vin) | Board - USB | 5V | Arduino UNO Shield | Arduino | 5V | Vmot
tDocu: Pull down resistors